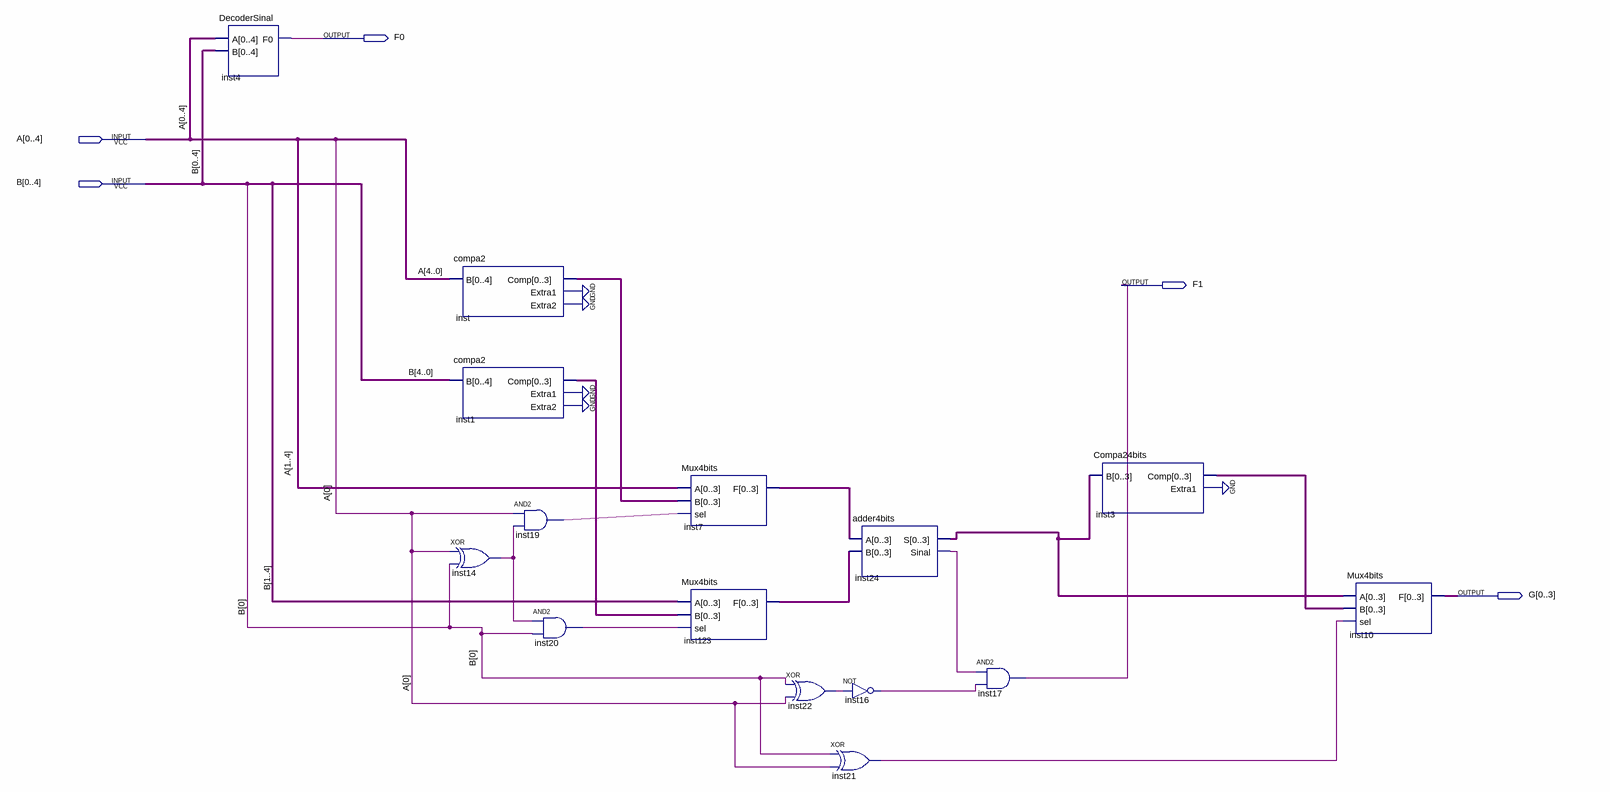
[diagram p0: schematic sheet]
// Quartus schematic somador.bdf as structural Verilog: 15 symbols, 5 pins
module somador (
  input  [0:4] A,
  input  [0:4] B,
  output F0,
  output F1,
  output [0:3] G
);

  wire inst1_extra1, inst1_extra2, inst3_extra1, inst14_out, inst16_out, inst19_out, inst20_out, inst21_out,
       inst22_out, inst24_sinal, inst_extra1, inst_extra2;
  wire [3:0] inst1_comp, inst3_comp, inst7_f, inst24_s, inst123_f, inst_comp;

  DecoderSinal inst4 (.A(A), .B(B), .F0(F0));
  compa2 inst (.B({A[4], A[3], A[2], A[1], A[0]}), .Comp(inst_comp), .Extra1(inst_extra1), .Extra2(inst_extra2));
  compa2 inst1 (.B({B[4], B[3], B[2], B[1], B[0]}), .Comp(inst1_comp), .Extra1(inst1_extra1), .Extra2(inst1_extra2));
  xor inst14 (inst14_out, A[0], B[0]);
  and inst19 (inst19_out, A[0], inst14_out);
  and inst20 (inst20_out, inst14_out, B[0]);
  Mux4bits inst7 (.A(A[1:4]), .B(inst_comp), .sel(inst19_out), .F(inst7_f));
  Mux4bits inst123 (.A(B[1:4]), .B(inst1_comp), .sel(inst20_out), .F(inst123_f));
  xor inst22 (inst22_out, B[0], A[0]);
  adder4bits inst24 (.A(inst7_f), .B(inst123_f), .S(inst24_s), .Sinal(inst24_sinal));
  not inst16 (inst16_out, inst22_out);
  xor inst21 (inst21_out, B[0], A[0]);
  and inst17 (F1, inst24_sinal, inst16_out);
  Compa24bits inst3 (.B(inst24_s), .Comp(inst3_comp), .Extra1(inst3_extra1));
  Mux4bits inst10 (.A(inst24_s), .B(inst3_comp), .sel(inst21_out), .F(G));
  // also tied to GND on the sheet: {inst_extra1, inst_extra2, inst1_extra1, inst1_extra2, inst3_extra1}
endmodule
